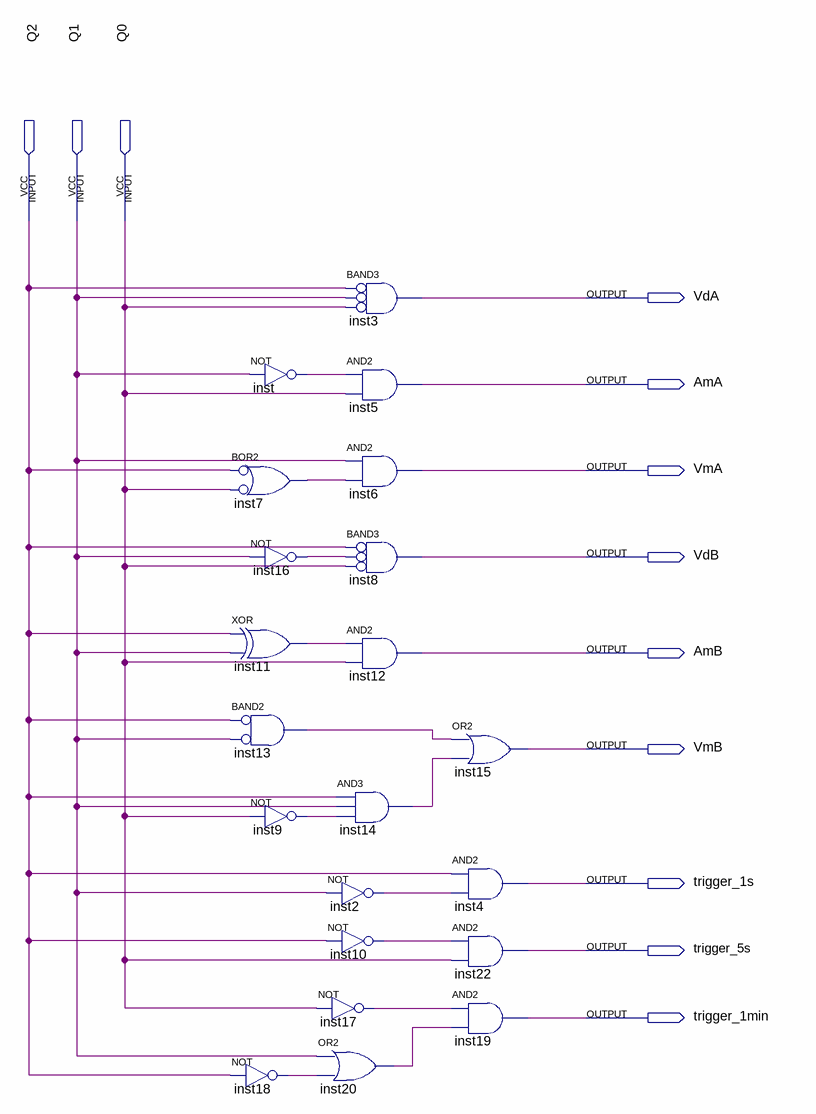
[diagram p0: schematic sheet]
// Quartus schematic logica_combinatoria.bdf as structural Verilog: 21 symbols, 12 pins
module logica_combinatoria (
  input  Q2,
  input  Q1,
  input  Q0,
  output VdA,
  output AmA,
  output VmA,
  output VdB,
  output AmB,
  output VmB,
  output trigger_1s,
  output trigger_5s,
  output trigger_1min
);

  wire inst2_out, inst7_out, inst9_out, inst10_out, inst11_out, inst13_out, inst14_out, inst16_out,
       inst17_out, inst18_out, inst20_out, inst_out;

  not inst (inst_out, Q1);
  or inst7 (inst7_out, ~Q2, ~Q0);  // BOR2
  not inst16 (inst16_out, Q1);
  xor inst11 (inst11_out, Q2, Q1);
  and inst13 (inst13_out, ~Q2, ~Q1);  // BAND2
  not inst9 (inst9_out, Q0);
  not inst18 (inst18_out, Q2);
  and inst14 (inst14_out, Q2, Q1, inst9_out);
  not inst2 (inst2_out, Q1);
  not inst10 (inst10_out, Q2);
  not inst17 (inst17_out, Q0);
  or inst20 (inst20_out, Q1, inst18_out);
  and inst3 (VdA, ~Q2, ~Q1, ~Q0);  // BAND3
  and inst5 (AmA, inst_out, Q0);
  and inst6 (VmA, Q1, inst7_out);
  and inst8 (VdB, ~Q2, ~inst16_out, ~Q0);  // BAND3
  and inst12 (AmB, inst11_out, Q0);
  or inst15 (VmB, inst13_out, inst14_out);
  and inst4 (trigger_1s, Q2, inst2_out);
  and inst22 (trigger_5s, inst10_out, Q0);
  and inst19 (trigger_1min, inst17_out, inst20_out);
endmodule
